# EAGLE design Syno_Ver1 (EAGLE 9.5.2)
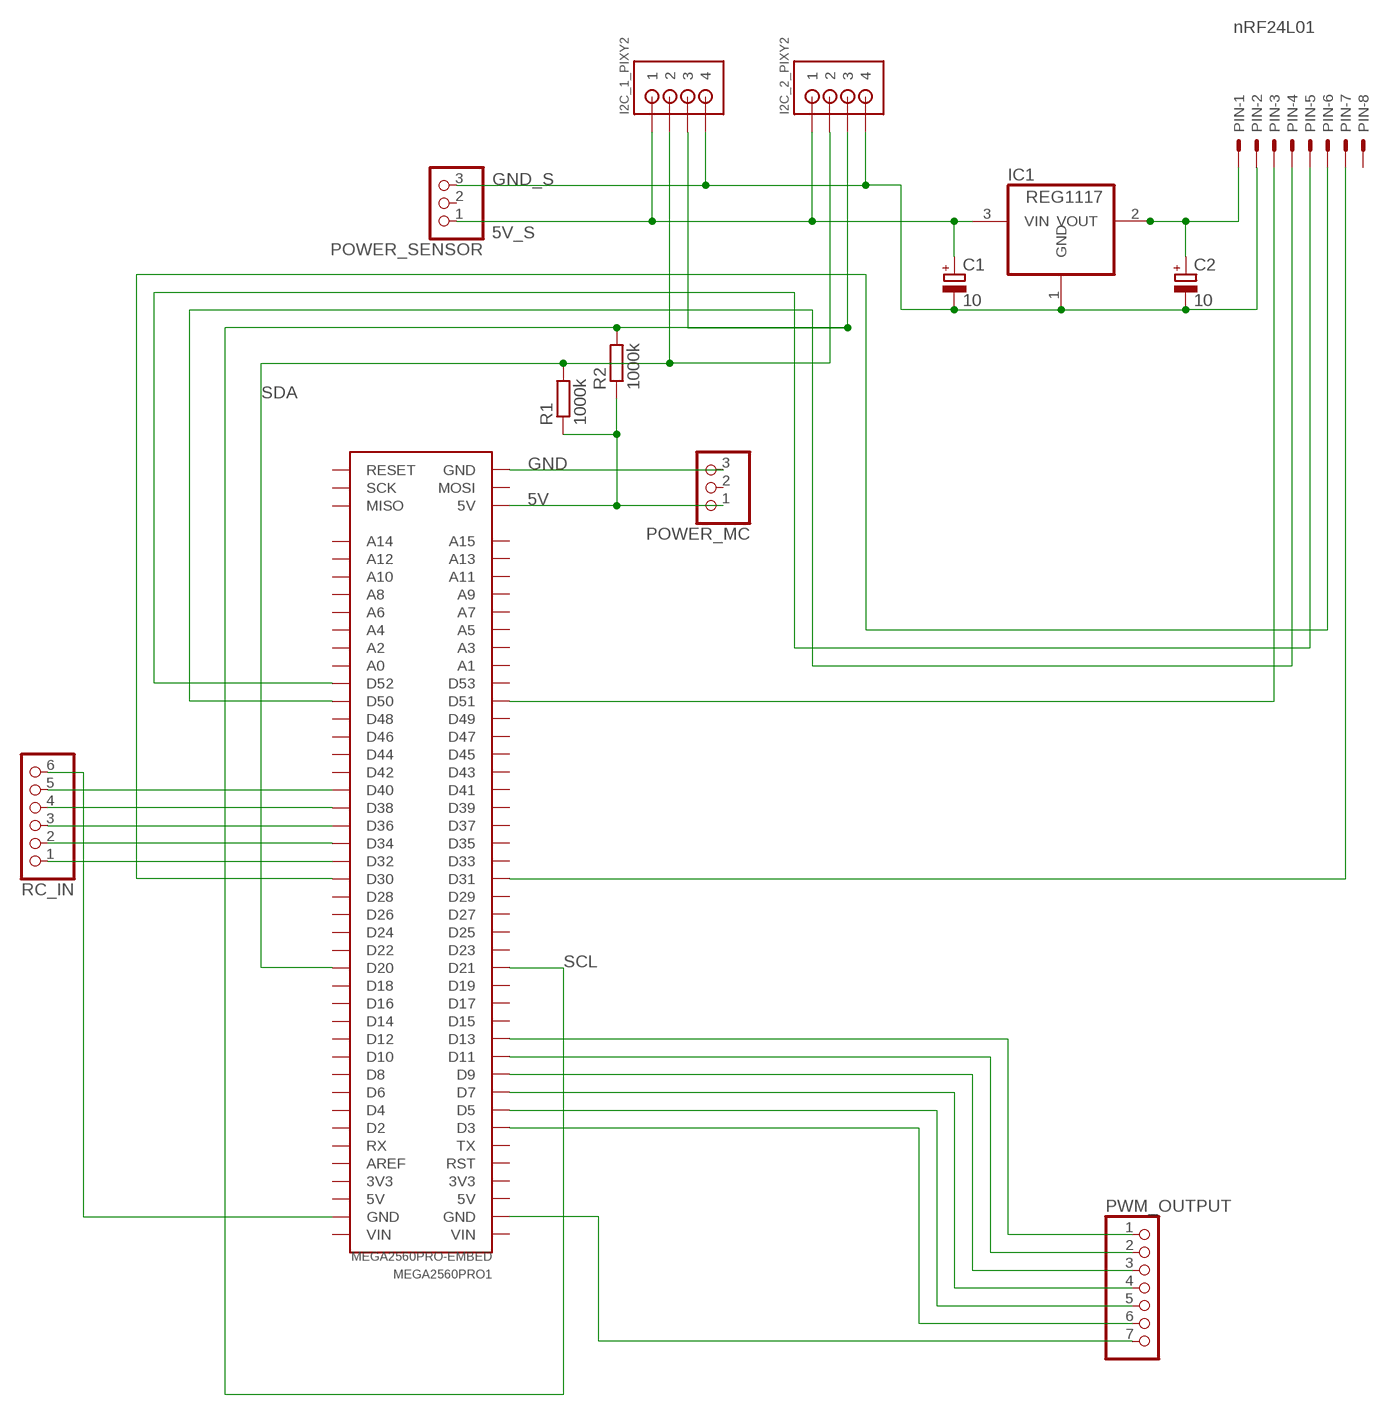
[diagram p0: schematic, sheet 1]

## Parts
C1  10  CPOL-EUE1.8-4  [E1,8-4]
C2  10  CPOL-EUE1.8-4  [E1,8-4]
I2C_1_PIXY2  JST-PH_4-PIN_HEADER  [JST_B4B-PH_HEADER]
I2C_2_PIXY2  JST-PH_4-PIN_HEADER  [JST_B4B-PH_HEADER]
IC1  REG1117  [SOT223]
MEGA2560PRO1  MEGA2560PRO-EMBED  [MEGA2560PRO-EMBED]
PIN  nRF24L01  JST-XH-08-PIN-ROUND-PAD  [JST-XH-08-PACKAGE-ROUND-PAD]
POWER_MC  PINHD-1X3/90  [1X03/90]
POWER_SENSOR  PINHD-1X3/90  [1X03/90]
PWM_OUTPUT  PINHD-1X7/90  [1X07/90]
R1  1000k  R-EU_0204/5  [0204/5]
R2  1000k  R-EU_0204/5  [0204/5]
RC_IN  PINHD-1X6/90  [1X06/90]

## Nets
5V: MEGA2560PRO1.5V@3(5V) POWER_MC.1 R1.1 R2.1
5V_S: C1.+ I2C_1_PIXY2.P1 I2C_2_PIXY2.P1 IC1.3(VIN) POWER_SENSOR.1
GND: MEGA2560PRO1.GND@3(GND) POWER_MC.3
GND_S: C1.- C2.- I2C_1_PIXY2.P4 I2C_2_PIXY2.P4 IC1.1(GND) PIN.2 POWER_SENSOR.3
N$1: MEGA2560PRO1.D51 PIN.3
N$2: C2.+ IC1.2(VOUT) PIN.1
N$3: MEGA2560PRO1.D50 PIN.4
N$4: MEGA2560PRO1.D52 PIN.5
N$5: MEGA2560PRO1.D30 PIN.6
N$6: MEGA2560PRO1.D31 PIN.7
N$7: MEGA2560PRO1.D13 PWM_OUTPUT.1
N$8: MEGA2560PRO1.D11 PWM_OUTPUT.2
N$9: MEGA2560PRO1.D9 PWM_OUTPUT.3
N$10: MEGA2560PRO1.D7 PWM_OUTPUT.4
N$11: MEGA2560PRO1.D5 PWM_OUTPUT.5
N$12: MEGA2560PRO1.D3 PWM_OUTPUT.6
N$13: MEGA2560PRO1.GND@1(GND) PWM_OUTPUT.7
N$14: MEGA2560PRO1.D32 RC_IN.1
N$15: MEGA2560PRO1.D34 RC_IN.2
N$16: MEGA2560PRO1.D36 RC_IN.3
N$17: MEGA2560PRO1.D38 RC_IN.4
N$18: MEGA2560PRO1.D40 RC_IN.5
N$19: MEGA2560PRO1.GND@2(GND) RC_IN.6
SCL: I2C_1_PIXY2.P3 I2C_2_PIXY2.P3 MEGA2560PRO1.D21 R2.2
SDA: I2C_1_PIXY2.P2 I2C_2_PIXY2.P2 MEGA2560PRO1.D20 R1.2
Unconnected: MEGA2560PRO1.3V3@1(3V3) MEGA2560PRO1.3V3@2(3V3) MEGA2560PRO1.5V@1(5V) MEGA2560PRO1.5V@2(5V) MEGA2560PRO1.A0 MEGA2560PRO1.A1 MEGA2560PRO1.A2 MEGA2560PRO1.A3 MEGA2560PRO1.A4 MEGA2560PRO1.A5 MEGA2560PRO1.A6 MEGA2560PRO1.A7 MEGA2560PRO1.A8 MEGA2560PRO1.A9 MEGA2560PRO1.A10 MEGA2560PRO1.A11 MEGA2560PRO1.A12 MEGA2560PRO1.A13 MEGA2560PRO1.A14 MEGA2560PRO1.A15 MEGA2560PRO1.AREF MEGA2560PRO1.D2 MEGA2560PRO1.D4 MEGA2560PRO1.D6 MEGA2560PRO1.D8 MEGA2560PRO1.D10 MEGA2560PRO1.D12 MEGA2560PRO1.D14 MEGA2560PRO1.D15 MEGA2560PRO1.D16 MEGA2560PRO1.D17 MEGA2560PRO1.D18 MEGA2560PRO1.D19 MEGA2560PRO1.D22 MEGA2560PRO1.D23 MEGA2560PRO1.D24 MEGA2560PRO1.D25 MEGA2560PRO1.D26 MEGA2560PRO1.D27 MEGA2560PRO1.D28 MEGA2560PRO1.D29 MEGA2560PRO1.D33 MEGA2560PRO1.D35 MEGA2560PRO1.D37 MEGA2560PRO1.D39 MEGA2560PRO1.D41 MEGA2560PRO1.D42 MEGA2560PRO1.D43 MEGA2560PRO1.D44 MEGA2560PRO1.D45 MEGA2560PRO1.D46 MEGA2560PRO1.D47 MEGA2560PRO1.D48 MEGA2560PRO1.D49 MEGA2560PRO1.D53 MEGA2560PRO1.MISO MEGA2560PRO1.MOSI MEGA2560PRO1.RESET MEGA2560PRO1.RST MEGA2560PRO1.RX MEGA2560PRO1.SCK MEGA2560PRO1.TX MEGA2560PRO1.VIN@1(VIN) MEGA2560PRO1.VIN@2(VIN) PIN.8 POWER_MC.2 POWER_SENSOR.2

## Library data of the parts
C1 C2 = rcl:CPOL-EU: POLARIZED CAPACITOR, European symbol; SPICEPREFIX: C
I2C_1_PIXY2 I2C_2_PIXY2 = srg:JST-PH_4-PIN_HEADER: 4-pin JST PH Shrouded Header, top entry P/N B4B-PH-K-S Mating connector PHR-4 Mating cable assembly: Sparkfun PRT-09916 <http://www.sparkfun.com/products/9916>
IC1 = burr-brown:REG1117: 800mA and 1A Low Dropout (LDO) Positive Regulator 1.8V, 2.5V, 2.85V, 3.3V, 5V, and Adj; MPN: REG1117; OC_FARNELL: 1097566; OC_NEWARK: 14P6981
MEGA2560PRO1 = robotdyn:MEGA2560PRO-EMBED: Robotdyn Robotdyn Mega 2560 PRO (Embed) https://robotdyn.com/mega-2560-pro-embed-ch340g-atmega2560-16au.html
PIN = Rembrandt Electronics - JST XH Connectors v1-0:JST-XH-08-PIN: JST XH Connector 2 Pin Wire to board connector. Pitch: 2,54 mm, (0.100") Number of pins: 8 Created by Rembrandt Electronics www.rembrandtelectronics.com
POWER_MC POWER_SENSOR = pinhead:PINHD-1X3: PIN HEADER
PWM_OUTPUT = pinhead:PINHD-1X7: PIN HEADER
R1 R2 = rcl:R-EU_: RESISTOR, European symbol; SPICEPREFIX: R
RC_IN = pinhead:PINHD-1X6: PIN HEADER

## Board
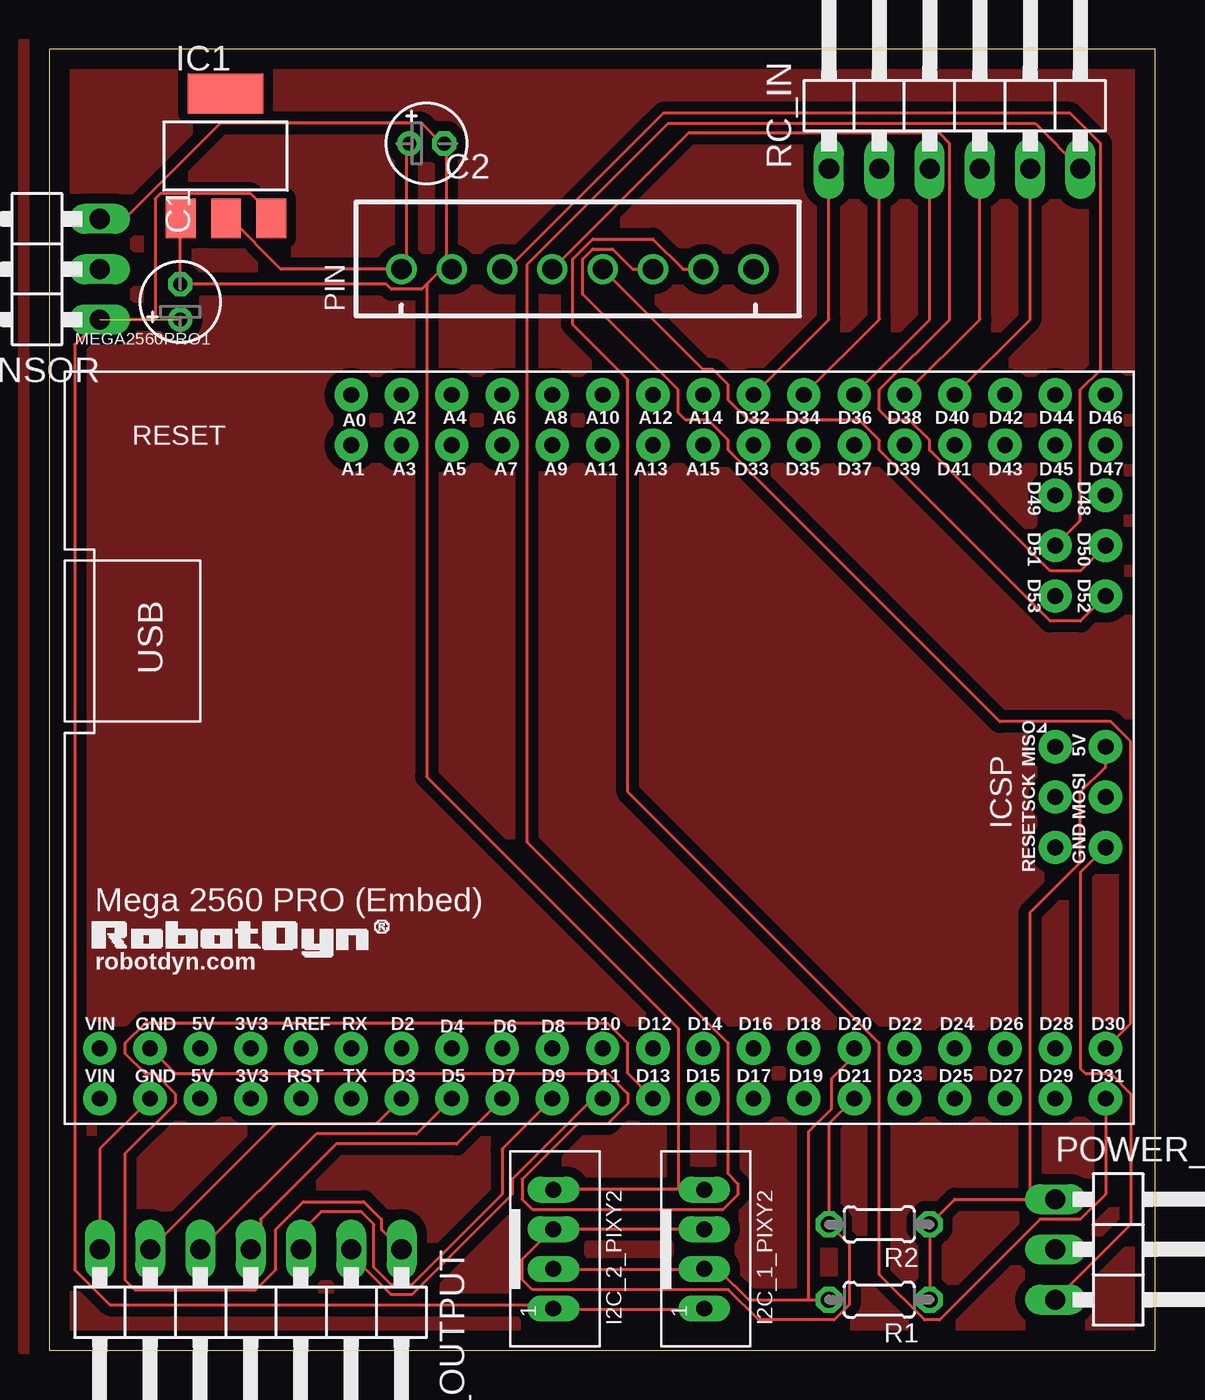
[diagram p1: board, top side]

Size 55.86 x 65.71 mm. Coordinates in mm from the lower left corner, seen from the top.
Outline: 0,0 55.86,0 55.86,65.71 0,65.71 0,0
Copper layers (1*16): Top 0.035mm / dielectric 1.5mm / Bottom 0.035mm
Design rules "default": minimum track width 6mil, minimum drill 0.35mm, track to track 6mil, track to pad 6mil, pad to pad 6mil, via to via 6mil, smd to smd 6mil, copper to edge 40mil, drill to drill 6mil, minimum pad ring 10mil, minimum via ring 8mil, stop-mask expansion 4mil, vias tented up to drill 0mil, thermal gap 10mil

### Footprints (pad centres in the part's own frame; a part is rotated, then mirrored left to right if it is on the bottom)
E1,8-4 = drill 0.711 pad 1.168: + -0.889,0 | drill 0.711 pad 1.168 octagon: - 0.889,0
JST_B4B-PH_HEADER = drill 0.8 long: P1 2.98,0.048; P2 0.98,0.048; P3 -1.02,0.048; P4 -3.02,0.048
SOT223 = smd 1.499 x 2.007: 1 -2.261,-3.15; 2 0.025,-3.15; 3 2.311,-3.15 | smd 3.81 x 2.007: 4 0,3.15
MEGA2560PRO-EMBED = drill 0.8 pad 1.676: 3V3@1 -25.4,-19.05; 3V3@2 -25.4,-16.51; 5V@1 -27.94,-19.05; 5V@2 -27.94,-16.51; 5V@3 17.78,-1.27; A0 -20.32,16.51; A1 -20.32,13.97; A2 -17.78,16.51; A3 -17.78,13.97; A4 -15.24,16.51; A5 -15.24,13.97; A6 -12.7,16.51; A7 -12.7,13.97; A8 -10.16,16.51; A9 -10.16,13.97; A10 -7.62,16.51; A11 -7.62,13.97; A12 -5.08,16.51; A13 -5.08,13.97; A14 -2.54,16.51; A15 -2.54,13.97; AREF -22.86,-16.51; D2 -17.78,-16.51; D3 -17.78,-19.05; D4 -15.24,-16.51; D5 -15.24,-19.05; D6 -12.7,-16.51; D7 -12.7,-19.05; D8 -10.16,-16.51; D9 -10.16,-19.05; D10 -7.62,-16.51; D11 -7.62,-19.05; D12 -5.08,-16.51; D13 -5.08,-19.05; D14 -2.54,-16.51; D15 -2.54,-19.05; D16 0,-16.51; D17 0,-19.05; D18 2.54,-16.51; D19 2.54,-19.05; D20 5.08,-16.51; D21 5.08,-19.05; D22 7.62,-16.51; D23 7.62,-19.05; D24 10.16,-16.51; D25 10.16,-19.05; D26 12.7,-16.51; D27 12.7,-19.05; D28 15.24,-16.51; D29 15.24,-19.05; D30 17.78,-16.51; D31 17.78,-19.05; D32 0,16.51; D33 0,13.97; D34 2.54,16.51; D35 2.54,13.97; D36 5.08,16.51; D37 5.08,13.97; D38 7.62,16.51; D39 7.62,13.97; D40 10.16,16.51; D41 10.16,13.97; D42 12.7,16.51; D43 12.7,13.97; D44 15.24,16.51; D45 15.24,13.97; D46 17.78,16.51; D47 17.78,13.97; D48 17.78,11.43; D49 15.24,11.43; D50 17.78,8.89; D51 15.24,8.89; D52 17.78,6.35; D53 15.24,6.35; GND@1 -30.48,-19.05; GND@2 -30.48,-16.51; GND@3 17.78,-6.35; MISO 15.24,-1.27; MOSI 17.78,-3.81; RESET 15.24,-6.35; RST -22.86,-19.05; RX -20.32,-16.51; SCK 15.24,-3.81; TX -20.32,-19.05; VIN@1 -33.02,-19.05; VIN@2 -33.02,-16.51
JST-XH-08-PACKAGE-ROUND-PAD = drill 1.016: 1 -8.89,0; 2 -6.35,0; 3 -3.81,0; 4 -1.27,0; 5 1.27,0; 6 3.81,0; 7 6.35,0; 8 8.89,0
1X03/90 = drill 1.016 long: 1 -2.54,-3.81; 2 0,-3.81; 3 2.54,-3.81
1X07/90 = drill 1.016 long: 1 -7.62,-3.81; 2 -5.08,-3.81; 3 -2.54,-3.81; 4 0,-3.81; 5 2.54,-3.81; 6 5.08,-3.81; 7 7.62,-3.81
0204/5 = drill 0.813 octagon: 1 -2.54,0; 2 2.54,0
1X06/90 = drill 1.016 long: 1 -6.35,-3.81; 2 -3.81,-3.81; 3 -1.27,-3.81; 4 1.27,-3.81; 5 3.81,-3.81; 6 6.35,-3.81

### Placement (x,y rotation side)
C1  6.6,52.96 90 top
C2  19.05,60.96 0 top
I2C_1_PIXY2  33.02,5.08 270 top
I2C_2_PIXY2  25.4,5.08 270 top
IC1  8.89,60.33 0 top
MEGA2560PRO1  35.56,31.75 0 top
PIN  26.67,54.61 0 top
POWER_MC  54.61,5.08 270 top
POWER_SENSOR  -1.27,54.61 90 top
PWM_OUTPUT  10.16,1.27 180 top
R1  41.91,2.54 180 top
R2  41.91,6.35 180 top
RC_IN  45.72,63.5 0 top

### Tracks (layer width: path | path; a pad name or v marks a point on that pad's centre or on a via)
5V
  Top 0.152: R1.1 R2.1 45.72,7.62 49.53,7.62 | MEGA2560PRO1.5V@3 53.34,29.46 52.07,28.19 52.07,24.64 49.53,22.1 49.53,7.62 | 49.53,7.62 POWER_MC.1
5V_S  (1 unrouted)
  Top 0.152: I2C_1_PIXY2.P1 33.02,2.03 25.65,2.03 I2C_2_PIXY2.P1 25.4,2.29 3.05,2.29 1.27,4.06 1.27,50.8 POWER_SENSOR.1 5.08,52.07 | IC1.3 11.18,57.4 10.16,58.42 5.59,58.42 5.33,58.17 5.33,52.07 5.08,52.07 | 5.08,52.07
ASD
  pour Top (isolate 0.508): -1.27,0 -1.27,66.04 55.88,66.04 55.88,0
GND
  Top 0.152: POWER_MC.3 54.61,6.35 54.61,12.95 53.59,13.97 52.32,13.97 52.07,14.22 52.07,24.13 MEGA2560PRO1.GND@3
GND_S
  Top 0.152: 31.75,8.13 33.02,8.13 I2C_1_PIXY2.P4 | 31.75,8.13 25.65,8.13 I2C_2_PIXY2.P4 | IC1.1 6.6,57.15 C1.- 17.02,53.85 17.27,53.59 18.8,53.59 19.05,53.85 | 20.07,54.86 20.07,60.96 C2.- 19.81,60.96 18.8,61.98 8.64,61.98 3.81,57.15 POWER_SENSOR.3 | 20.07,54.86 19.05,53.85 | 20.07,54.86 PIN.2 | 31.75,8.13 31.75,16.26 19.05,28.96 19.05,53.85
N$1
  Top 0.152: PIN.3 23.11,54.61 30.99,62.48 51.56,62.48 53.09,60.96 53.09,49.53 52.07,48.51 52.07,41.91 MEGA2560PRO1.D51
N$2
  Top 0.152: IC1.2 9.14,57.15 11.68,54.61 PIN.1 18.03,54.86 18.03,60.96 C2.+
N$3
  Top 0.152: PIN.4 32.26,61.47 44.96,61.47 45.47,60.96 45.47,52.07 41.91,48.51 41.91,47.5 42.42,46.99 43.43,46.99 44.45,45.97 44.45,45.47 50.55,39.37 52.07,39.37 MEGA2560PRO1.D50
N$4
  Top 0.152: PIN.5 33.02,49.53 33.53,49.53 34.29,48.77 34.29,48.01 35.31,46.99 40.89,46.99 41.91,45.97 41.91,45.47 50.55,36.83 52.07,36.83 MEGA2560PRO1.D52
N$5
  Top 0.152: PIN.6 29.46,54.61 28.45,55.63 27.43,55.63 26.92,55.12 26.92,53.34 31.75,48.51 31.75,47.37 32.13,46.99 33.27,46.99 34.29,45.97 34.29,45.47 48.01,31.75 53.59,31.75 54.61,30.73 54.61,16.51 MEGA2560PRO1.D30
N$6
  Top 0.152: PIN.7 32,54.61 30.48,56.13 27.43,56.13 26.42,55.12 26.42,51.82 29.21,49.02 29.21,28.19 41.91,15.49 41.91,3.81 44.2,1.52 44.96,1.52 50.04,6.6 52.07,6.6 53.34,7.87 MEGA2560PRO1.D31
N$7
  Top 0.152: PWM_OUTPUT.1 16.76,6.1 16.76,6.6 15.88,7.49 12.83,7.49 11.43,6.1 11.43,4.06 10.41,3.05 4.32,3.05 3.81,3.56 3.81,9.91 6.35,12.45 6.35,12.95 5.33,13.97 4.83,13.97 3.81,14.99 3.81,15.49 4.83,16.51 28.19,16.51 29.21,15.49 29.21,13.97 MEGA2560PRO1.D13
N$8
  Top 0.152: PWM_OUTPUT.2 15.75,4.57 15.75,4.32 17.27,2.79 18.29,2.79 23.37,7.87 23.37,8.64 27.43,12.7 MEGA2560PRO1.D11
N$9
  Top 0.152: PWM_OUTPUT.3 12.7,5.97 13.72,6.99 15.75,6.99 16.38,6.35 16.38,4.19 17.27,3.3 18.29,3.3 22.86,7.87 22.86,10.16 MEGA2560PRO1.D9
N$10
  Top 0.152: PWM_OUTPUT.4 10.67,5.59 10.67,6.6 14.48,10.41 20.57,10.41 MEGA2560PRO1.D7
N$11
  Top 0.152: PWM_OUTPUT.5 13.46,10.92 18.54,10.92 MEGA2560PRO1.D5
N$12
  Top 0.152: PWM_OUTPUT.6 11.43,11.43 16.51,11.43 MEGA2560PRO1.D3
N$13
  Top 0.152: PWM_OUTPUT.7 2.54,10.16 MEGA2560PRO1.GND@1
N$14
  Top 0.152: RC_IN.1 39.37,52.07 MEGA2560PRO1.D32
N$15
  Top 0.152: RC_IN.2 41.91,52.07 MEGA2560PRO1.D34
N$16
  Top 0.152: RC_IN.3 44.45,52.07 MEGA2560PRO1.D36
N$17
  Top 0.152: RC_IN.4 46.99,52.07 MEGA2560PRO1.D38
N$18
  Top 0.152: RC_IN.5 49.53,52.07 MEGA2560PRO1.D40
N$19
  Top 0.152: RC_IN.6 49.78,61.98 31.24,61.98 24.13,54.86 24.13,25.65 34.29,15.49 34.29,8.89 34.8,8.38 34.8,7.87 34.04,7.11 24.38,7.11 23.88,7.62 23.88,8.64 26.67,11.43 28.19,11.43 29.21,12.45 29.21,12.95 28.19,13.97 6.35,13.97 MEGA2560PRO1.GND@2
SCL
  Top 0.152: I2C_1_PIXY2.P3 33.02,6.1 25.65,6.1 I2C_2_PIXY2.P3 25.4,6.1 23.88,4.57 23.88,3.56 24.38,3.05 34.29,3.05 35.81,1.52 39.62,1.52 40.39,2.29 40.39,5.33 R2.2 39.37,11.43 MEGA2560PRO1.D21
SDA
  Top 0.152: I2C_2_PIXY2.P2 25.65,4.06 33.02,4.06 I2C_1_PIXY2.P2 33.27,4.06 33.78,4.06 35.31,2.54 38.35,2.54 | 38.35,2.54 R1.2 | MEGA2560PRO1.D20 40.64,14.86 39.5,13.72 39.5,12.19 38.35,11.05 38.35,2.54